# Altium project hydra_power.PrjPcb
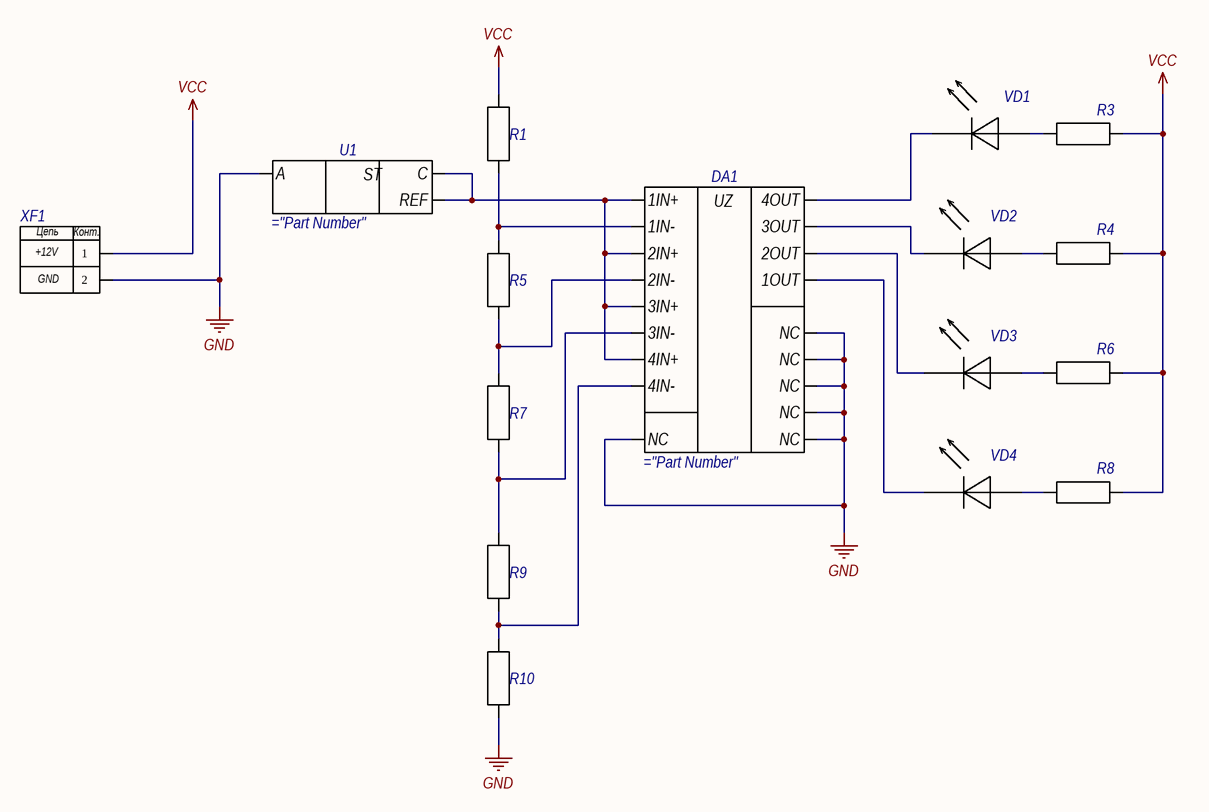
[diagram p0: scheme_hydra_power.SchDoc]
1 sheet, 16 parts. Net scope: global (net labels, ports and power ports of the same name join across sheets).
Board file: pcb_hydra_power.PcbDoc

## Sheet scheme_hydra_power.SchDoc: Измерительный блок
size 594 x 420 mm; Date: 25.04.26; DrawnBy: Rozanov F.M; SheetNumber: 1; SheetTotal: 1

### Parts
DA1  (no value)
R1  R  (value not drawn)
R3  R  (value not drawn)
R4  R  (value not drawn)
R5  R  (value not drawn)
R6  R  (value not drawn)
R7  R  (value not drawn)
R8  R  (value not drawn)
R9  R  (value not drawn)
R10  R  (value not drawn)
U1  (no value)
VD1  Led_diod  (value not drawn)
VD2  Led_diod  (value not drawn)
VD3  Led_diod  (value not drawn)
VD4  Led_diod  (value not drawn)
XF1  PIN_POWER  (value not drawn)

### Nets
GND: DA1.1(NC) DA1.5(NC) DA1.7(NC) DA1.11(NC) DA1.15(NC) DA1.17(NC) R10.1 U1.3(A) XF1.2
VCC: R1.2 R3.2 R4.2 R6.2 R8.2 XF1.1
NetDA1_2: DA1.2(1OUT) VD4.2
NetDA1_3: DA1.3(2OUT) VD3.2
NetDA1_6: DA1.6(2IN-) R5.1 R7.2
NetDA1_8: DA1.8(2IN+) DA1.10(1IN+) DA1.13(3IN+) DA1.16(4IN+) U1.1(C) U1.2(REF)
NetDA1_9: DA1.9(1IN-) R1.1 R5.2
NetDA1_12: DA1.12(3IN-) R7.1 R9.2
NetDA1_14: DA1.14(4IN-) R9.1 R10.2
NetDA1_19: DA1.19(4OUT) VD1.2
NetDA1_20: DA1.20(3OUT) VD2.2
NetR3_1: R3.1 VD1.1
NetR4_1: R4.1 VD2.1
NetR6_1: R6.1 VD3.1
NetR8_1: R8.1 VD4.1

Not connected (* = marked no-connect by the designer): DA1 4(VCC) 18(GND)

### Notes on the sheet
- Перв. примен.
- Справ. №
- Подп. и дата
- Инв. № дубл.
- Взам. инв. №
- Разраб.
- Изм.
- Лист
- № докум.
- Подп.
- Дата
- Лит.
- Масса
- Масштаб
- Пров.
- Т.контр.
- Схема электрическая принципиальная
- Листов
- Инв. № подл.
- Утв.
- Н.контр.
- Копировал
- Формат А2
- (in symbol LM139) UZ
- (in symbol PIN_POWER) Цепь; Конт.; +12V; GND
- (in symbol TLA431) ST

### Library data of the parts
DA1 = LM139
U1 = TLA431